# Altium project Titanium_v1.0.PrjPcb
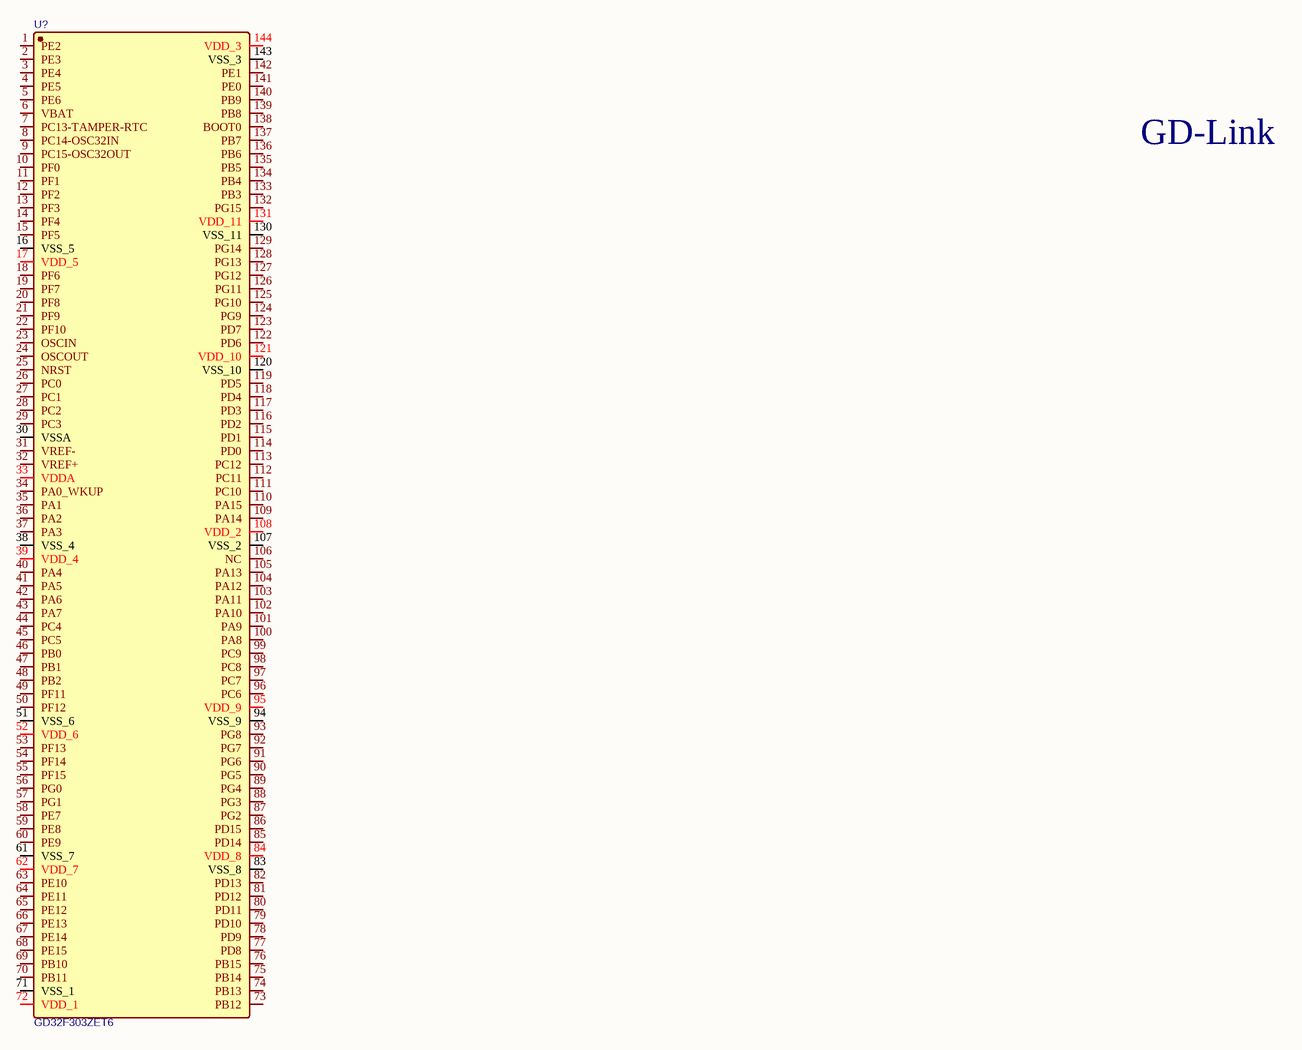
[diagram p0: MainCore.SchDoc]
5 sheets, 29 parts. Net scope: global (net labels, ports and power ports of the same name join across sheets).
Board file: Titanium_v1.0.pcbdoc
Sheets:
  MainCore.SchDoc
  Power.SchDoc
  ROM.SchDoc
  Peripherals.SchDoc
  WIFI.SchDoc

## Sheet MainCore.SchDoc
size A3

### Parts
(Parts that share a designator on the sheet are numbered #1, #2 ... from top to bottom, then left to right.)
U?#1  GD32F303ZET6  [LQFP144 20X20]

### Nets

Not connected (* = marked no-connect by the designer): U?#1 1(PE2) 2(PE3) 3(PE4) 4(PE5) 5(PE6) 6(VBAT) 7(PC13-TAMPER-RTC) 8(PC14-OSC32IN) 9(PC15-OSC32OUT) 10(PF0) 11(PF1) 12(PF2) 13(PF3) 14(PF4) 15(PF5) 16(VSS_5) 17(VDD_5) 18(PF6) 19(PF7) 20(PF8) 21(PF9) 22(PF10) 23(OSCIN) 24(OSCOUT) 25(NRST) 26(PC0) 27(PC1) 28(PC2) 29(PC3) 30(VSSA) 31(VREF-) 32(VREF+) 33(VDDA) 34(PA0_WKUP) 35(PA1) 36(PA2) 37(PA3) 38(VSS_4) 39(VDD_4) 40(PA4) 41(PA5) 42(PA6) 43(PA7) 44(PC4) 45(PC5) 46(PB0) 47(PB1) 48(PB2) 49(PF11) 50(PF12) 51(VSS_6) 52(VDD_6) 53(PF13) 54(PF14) 55(PF15) 56(PG0) 57(PG1) 58(PE7) 59(PE8) 60(PE9) 61(VSS_7) 62(VDD_7) 63(PE10) 64(PE11) 65(PE12) 66(PE13) 67(PE14) 68(PE15) 69(PB10) 70(PB11) 71(VSS_1) 72(VDD_1) 73(PB12) 74(PB13) 75(PB14) 76(PB15) 77(PD8) 78(PD9) 79(PD10) 80(PD11) 81(PD12) 82(PD13) 83(VSS_8) 84(VDD_8) 85(PD14) 86(PD15) 87(PG2) 88(PG3) 89(PG4) 90(PG5) 91(PG6) 92(PG7) 93(PG8) 94(VSS_9) 95(VDD_9) 96(PC6) 97(PC7) 98(PC8) 99(PC9) 100(PA8) 101(PA9) 102(PA10) 103(PA11) 104(PA12) 105(PA13) 106(NC) 107(VSS_2) 108(VDD_2) 109(PA14) 110(PA15) 111(PC10) 112(PC11) 113(PC12) 114(PD0) 115(PD1) 116(PD2) 117(PD3) 118(PD4) 119(PD5) 120(VSS_10) 121(VDD_10) 122(PD6) 123(PD7) 124(PG9) 125(PG10) 126(PG11) 127(PG12) 128(PG13) 129(PG14) 130(VSS_11) 131(VDD_11) 132(PG15) 133(PB3) 134(PB4) 135(PB5) 136(PB6) 137(PB7) 138(BOOT0) 139(PB8) 140(PB9) 141(PE0) 142(PE1) 143(VSS_3) 144(VDD_3)

### Notes on the sheet
- GD-Link

### Library data of the parts
U?#1 = GD32F303ZET6: BOM_Manufacturer: GigaDevice Semicon Beijing; Contributor: LCSC; BOM_Supplier: LCSC; BOM_Supplier Part: C962267; BOM_Manufacturer Part: GD32F303ZET6; BOM_JLCPCB Part Class: Extended Part; spicePre: U; spiceSymbolName: GD32F303ZET6

## Sheet Power.SchDoc
size A4
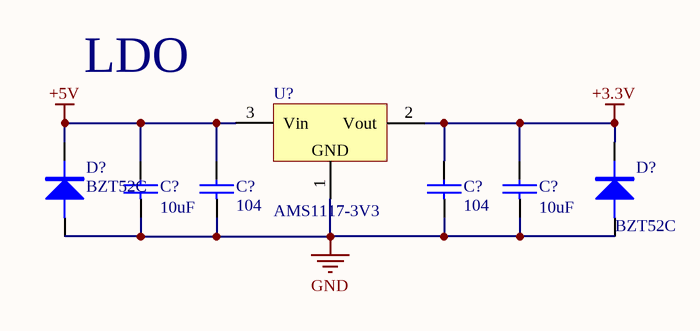
[diagram p1: Power.SchDoc]

### Parts
(Parts that share a designator on the sheet are numbered #1, #2 ... from top to bottom, then left to right.)
C?#1  10uF  [0603C]
C?#2  104  [0603C]
C?#3  104  [0603C]
C?#4  10uF  [0603C]
D?#1  BZT52C  [SOD-123]
D?#2  BZT52C  [SOD-123]
U?#2  AMS1117-3V3  [SOT89]

### Nets
+3.3V: C?#3.2 C?#4.2 D?#2.K U?#2.2(Vout)
+5V: C?#1.2 C?#2.2 D?#1.K U?#2.3(Vin)
GND: C?#1.1 C?#2.1 C?#3.1 C?#4.1 D?#1.A D?#2.A U?#2.1(GND)

### Notes on the sheet
- LDO

### Library data of the parts
C?#1-C?#4 = CAP: 无极性电容
D?#1 D?#2 = DIODE: 普通二极管
U?#2 = AMS1117: 三端稳压芯片; BOM名称: 稳压芯片; 版权归属: 源创客; 学习资源: www.ooocke.com

## Sheet ROM.SchDoc
size A4
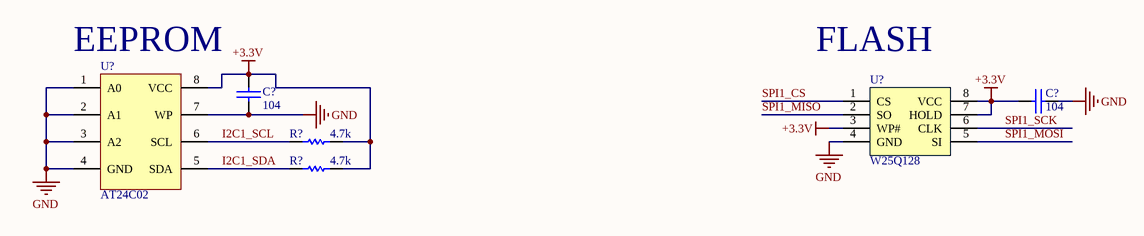
[diagram p2: ROM.SchDoc]

### Parts
(Parts that share a designator on the sheet are numbered #1, #2 ... from top to bottom, then left to right.)
C?#5  104  [0603C]
C?#6  104  [0603C]
R?#1  4.7k  [0603R]
R?#2  4.7k  [0603R]
U?#3  AT24C02  [SOP8]
U?#4  W25Q128  [SOIC8]

### Nets
+3.3V: C?#5.2 C?#6.2 R?#1.2 R?#2.2 U?#3.8(VCC) U?#4.3(WP#) U?#4.7(HOLD) U?#4.8(VCC)
GND: C?#5.1 C?#6.1 U?#3.1(A0) U?#3.2(A1) U?#3.3(A2) U?#3.4(GND) U?#3.7(WP) U?#4.4(GND)
I2C1_SCL: R?#1.1 U?#3.6(SCL)
I2C1_SDA: R?#2.1 U?#3.5(SDA)
SPI1_CS: U?#4.1(CS)
SPI1_MISO: U?#4.2(SO)
SPI1_MOSI: U?#4.5(SI)
SPI1_SCK: U?#4.6(CLK)

### Notes on the sheet
- (near U?#3) EEPROM
- (near U?#4) FLASH

### Library data of the parts
C?#5 C?#6 = CAP: 无极性电容
R?#1 R?#2 = RES

## Sheet Peripherals.SchDoc
size A4
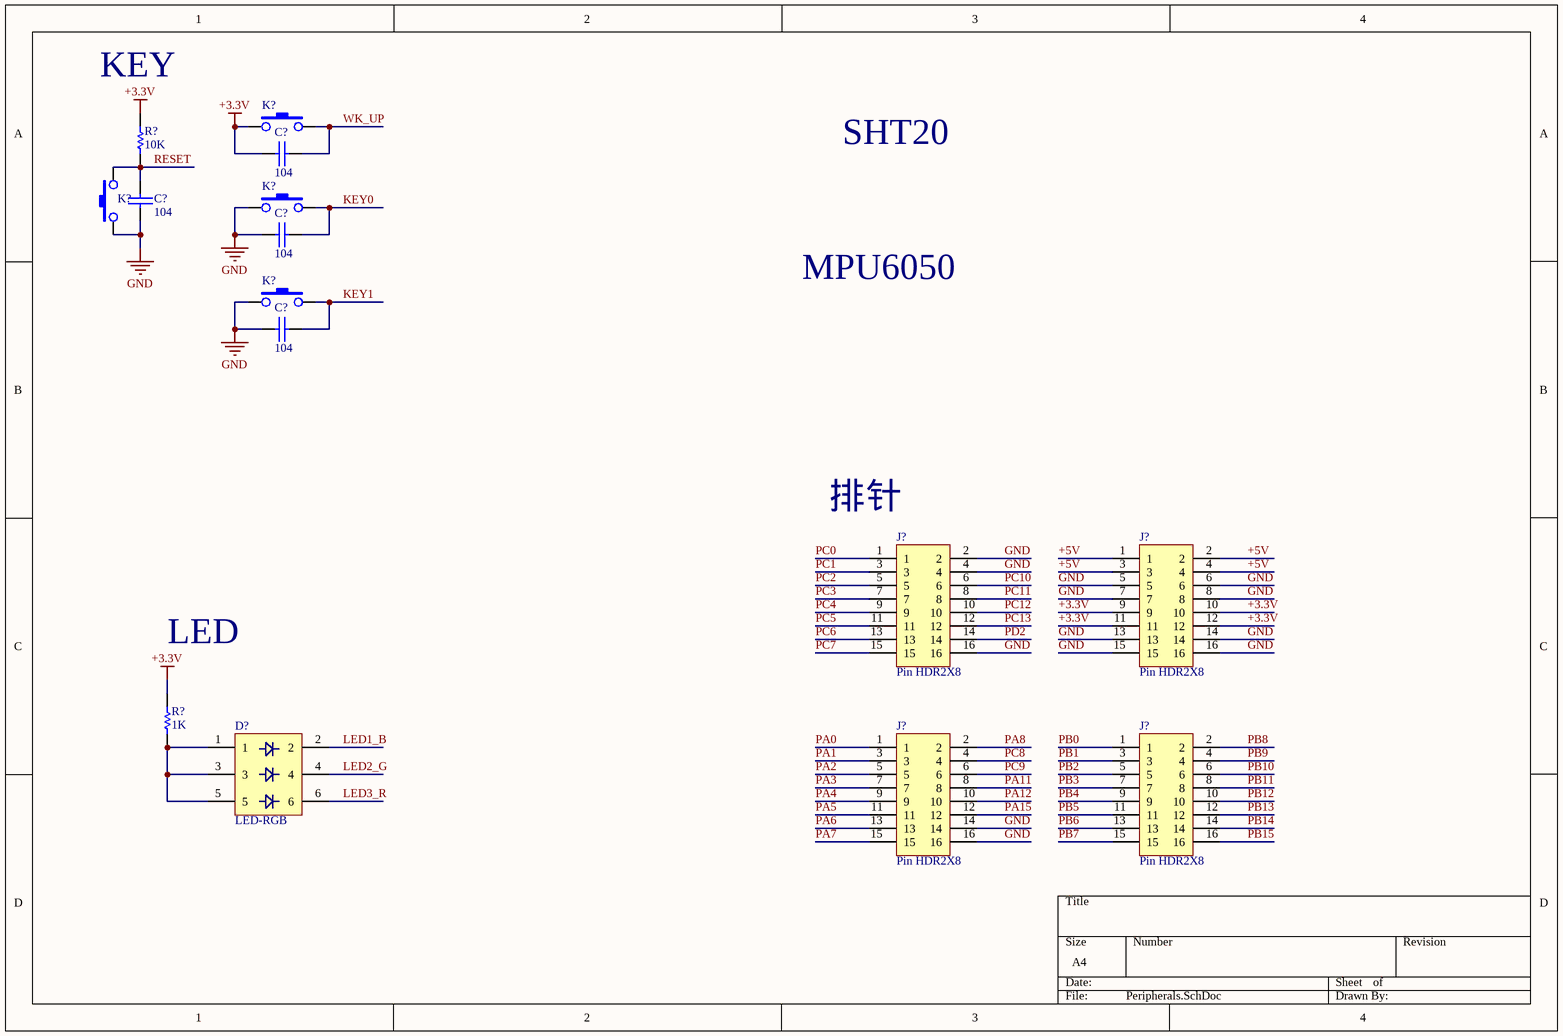
[diagram p3: Peripherals.SchDoc]

### Parts
(Parts that share a designator on the sheet are numbered #1, #2 ... from top to bottom, then left to right.)
C?#7  104  [0603C]
C?#8  104  [0603C]
C?#9  104  [0603C]
C?#10  104  [0603C]
D?#3  LED-RGB  [LED-5050W]
J?#1  Pin HDR2X8  [Pin HDR2X8/2.54mm-S]
J?#2  Pin HDR2X8  [Pin HDR2X8/2.54mm-S]
J?#3  Pin HDR2X8  [Pin HDR2X8/2.54mm-S]
J?#4  Pin HDR2X8  [Pin HDR2X8/2.54mm-S]
K?#1  KEY  [DIP-6X6X5]  (value not drawn)
K?#2  KEY  [DIP-6X6X5]  (value not drawn)
K?#3  KEY  [DIP-6X6X5]  (value not drawn)
K?#4  KEY  [DIP-6X6X5]  (value not drawn)
R?#3  10K  [0603R]
R?#4  1K  [0603R]

### Nets
+3.3V: C?#7.1 J?#2.9 J?#2.10 J?#2.11 J?#2.12 K?#1.1 R?#3.2 R?#4.2
+5V: J?#2.1 J?#2.2 J?#2.3 J?#2.4
GND: C?#8.1 C?#9.1 C?#10.1 J?#1.2 J?#1.4 J?#1.16 J?#2.5 J?#2.6 J?#2.7 J?#2.8 J?#2.13 J?#2.14 J?#2.15 J?#2.16 J?#3.14 J?#3.16 K?#2.1 K?#3.1 K?#4.1
KEY0: C?#9.2 K?#2.3
KEY1: C?#10.2 K?#4.3
LED1_B: D?#3.2
LED2_G: D?#3.4
LED3_R: D?#3.6
PA0: J?#3.1
PA1: J?#3.3
PA2: J?#3.5
PA3: J?#3.7
PA4: J?#3.9
PA5: J?#3.11
PA6: J?#3.13
PA7: J?#3.15
PA8: J?#3.2
PA11: J?#3.8
PA12: J?#3.10
PA15: J?#3.12
PB0: J?#4.1
PB1: J?#4.3
PB2: J?#4.5
PB3: J?#4.7
PB4: J?#4.9
PB5: J?#4.11
PB6: J?#4.13
PB7: J?#4.15
PB8: J?#4.2
PB9: J?#4.4
PB10: J?#4.6
PB11: J?#4.8
PB12: J?#4.10
PB13: J?#4.12
PB14: J?#4.14
PB15: J?#4.16
PC0: J?#1.1
PC1: J?#1.3
PC2: J?#1.5
PC3: J?#1.7
PC4: J?#1.9
PC5: J?#1.11
PC6: J?#1.13
PC7: J?#1.15
PC8: J?#3.4
PC9: J?#3.6
PC10: J?#1.6
PC11: J?#1.8
PC12: J?#1.10
PC13: J?#1.12
PD2: J?#1.14
RESET: C?#8.2 K?#3.3 R?#3.1
WK_UP: C?#7.2 K?#1.3
NetD?#3_1: D?#3.1 D?#3.3 D?#3.5 R?#4.1

### Notes on the sheet
- (near R?#3) KEY
- SHT20
- MPU6050
- (near J?#1) 排针
- LED

### Library data of the parts
C?#7-C?#10 = CAP: 无极性电容
D?#3 = LED-5050
R?#3 R?#4 = RES

## Sheet WIFI.SchDoc
size A4

## Nets that join several sheets
+3.3V: Power (C?#3.2 C?#4.2 D?#2.K U?#2.2), ROM (8 pins), Peripherals (8 pins)
+5V: Power (C?#1.2 C?#2.2 D?#1.K U?#2.3), Peripherals (J?#2.1 J?#2.2 J?#2.3 J?#2.4)
GND: Power (7 pins), ROM (8 pins), Peripherals (19 pins)